# EAGLE schematic Slinea_velocistaEdu (EAGLE 6.5.0)
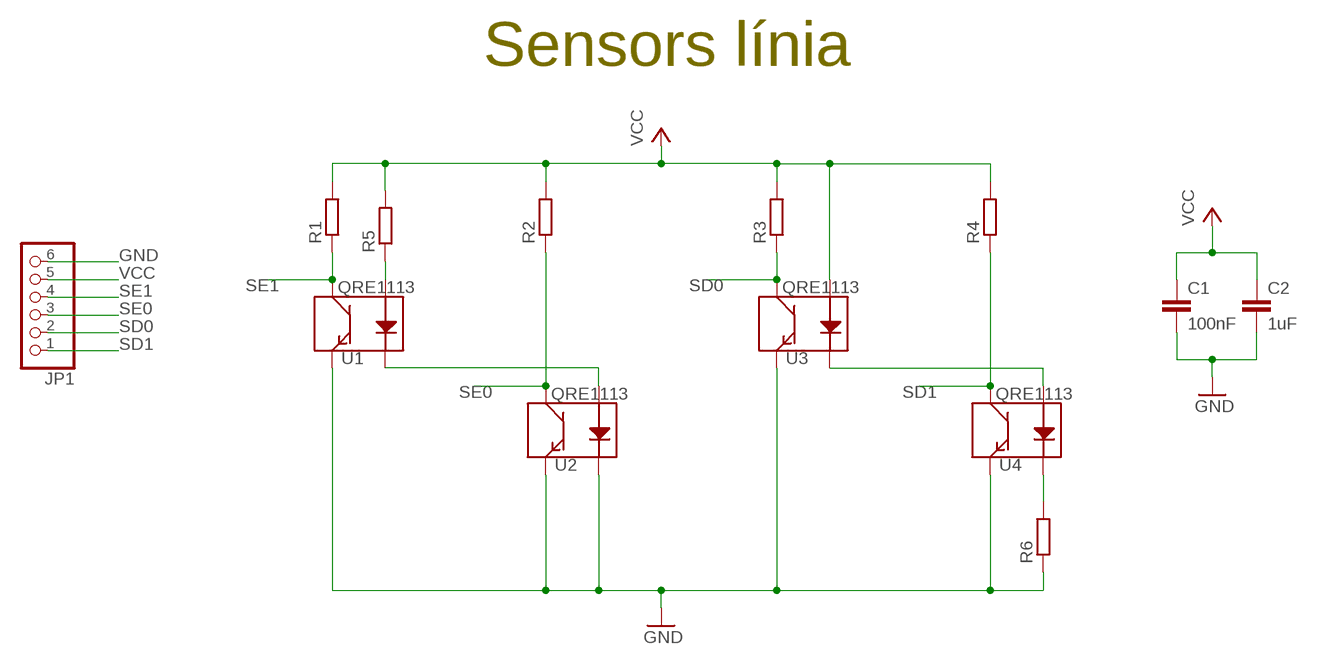
[diagram p0: schematic, sheet 1]

## Parts
C1  100nF  C-EUC0805  [C0805]
C2  1uF  C-EUC0805  [C0805]
JP1  PINHD-1X6  [1X06]
R1  R-EU_M0805  [M0805@1]
R2  R-EU_M0805  [M0805]
R3  R-EU_M0805  [M0805]
R4  R-EU_M0805  [M0805]
R5  R-EU_M0805  [M0805]
R6  R-EU_M0805  [M0805]
U1  QRE1113  [QRE1113]
U2  QRE1113  [QRE1113]
U3  QRE1113  [QRE1113]
U4  QRE1113  [QRE1113]

## Nets
GND: C1.2 C2.2 JP1.6 R6.1 U1.4(E) U2.2(K) U2.4(E) U3.4(E) U4.4(E)
N$1: R6.2 U4.2(K)
N$63: U1.2(K) U2.1(A)
N$65: U3.2(K) U4.1(A)
N$67: R5.1 U1.1(A)
SD0: JP1.2 R3.1 U3.3(C)
SD1: JP1.1 R4.1 U4.3(C)
SE0: JP1.3 R2.1 U2.3(C)
SE1: JP1.4 R1.1 U1.3(C)
VCC: C1.1 C2.1 JP1.5 R1.2 R2.2 R3.2 R4.2 R5.2 U3.1(A)

## Notes on the sheet
- Sensors línia

## Library data of the parts
C1 C2 = rcl:C-EU: CAPACITOR, European symbol
JP1 = adafruit:PINHD-1X6: PIN HEADER
R1 = resistor:R-EU_: RESISTOR, European symbol
R2-R6 = rcl:R-EU_: RESISTOR, European symbol
U1-U4 = SparkFun:QRE1113